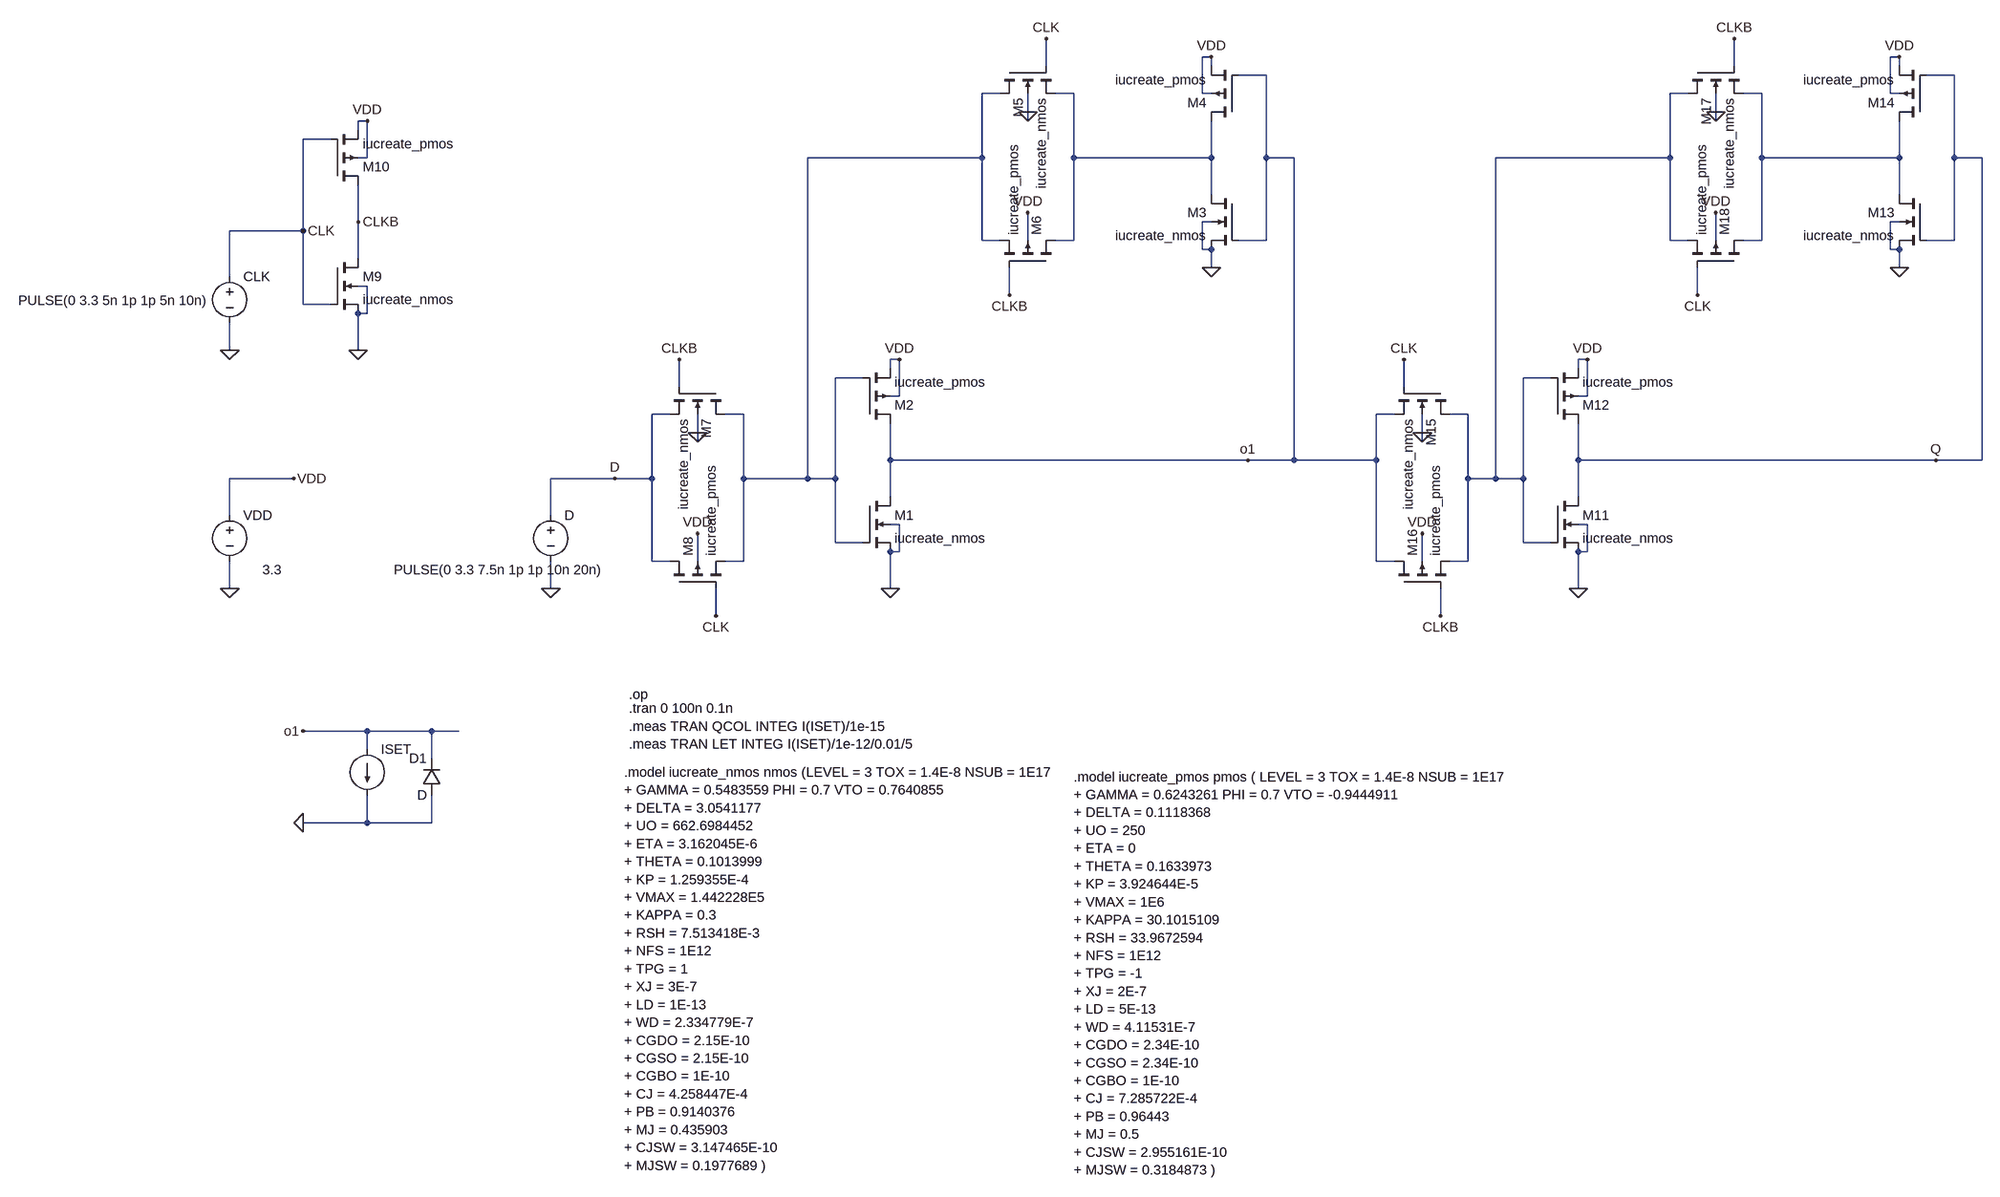
[diagram p0: schematic see_hw_dff_p1.asc]
see_hw_dff_p1.asc, the LTspice schematic file:
Version 4
SHEET 1 2536 1352
WIRE 1024 -736 1008 -736
WIRE 2224 -736 2208 -736
WIRE 736 -720 736 -768
WIRE 1024 -720 1024 -736
WIRE 1936 -720 1936 -768
WIRE 2224 -720 2224 -736
WIRE 1120 -704 1072 -704
WIRE 2320 -704 2272 -704
WIRE 656 -672 624 -672
WIRE 784 -672 752 -672
WIRE 1008 -672 1008 -736
WIRE 1024 -672 1008 -672
WIRE 1856 -672 1824 -672
WIRE 1984 -672 1952 -672
WIRE 2208 -672 2208 -736
WIRE 2224 -672 2208 -672
WIRE 704 -640 704 -672
WIRE 1904 -640 1904 -672
WIRE -448 -624 -464 -624
WIRE 704 -624 704 -640
WIRE 1904 -624 1904 -640
WIRE -464 -608 -464 -624
WIRE -512 -592 -560 -592
WIRE -448 -560 -448 -624
WIRE -448 -560 -464 -560
WIRE 624 -560 624 -672
WIRE 624 -560 320 -560
WIRE 784 -560 784 -672
WIRE 1024 -560 1024 -624
WIRE 1024 -560 784 -560
WIRE 1120 -560 1120 -704
WIRE 1168 -560 1120 -560
WIRE 1824 -560 1824 -672
WIRE 1824 -560 1520 -560
WIRE 1984 -560 1984 -672
WIRE 2224 -560 2224 -624
WIRE 2224 -560 1984 -560
WIRE 2320 -560 2320 -704
WIRE 2368 -560 2320 -560
WIRE 1024 -496 1024 -560
WIRE 2224 -496 2224 -560
WIRE -464 -448 -464 -512
WIRE 1024 -448 1008 -448
WIRE 2224 -448 2208 -448
WIRE -560 -432 -560 -592
WIRE -560 -432 -688 -432
WIRE 624 -416 624 -560
WIRE 656 -416 624 -416
WIRE 704 -416 704 -464
WIRE 784 -416 784 -560
WIRE 784 -416 752 -416
WIRE 1120 -416 1120 -560
WIRE 1120 -416 1072 -416
WIRE 1824 -416 1824 -560
WIRE 1856 -416 1824 -416
WIRE 1904 -416 1904 -464
WIRE 1984 -416 1984 -560
WIRE 1984 -416 1952 -416
WIRE 2320 -416 2320 -560
WIRE 2320 -416 2272 -416
WIRE 1008 -400 1008 -448
WIRE 1024 -400 1008 -400
WIRE 2208 -400 2208 -448
WIRE 2224 -400 2208 -400
WIRE -464 -384 -464 -448
WIRE 1024 -368 1024 -400
WIRE 2224 -368 2224 -400
WIRE -688 -352 -688 -432
WIRE -448 -336 -464 -336
WIRE 672 -320 672 -368
WIRE 1872 -320 1872 -368
WIRE -560 -304 -560 -432
WIRE -512 -304 -560 -304
WIRE -448 -288 -448 -336
WIRE -448 -288 -464 -288
WIRE -688 -224 -688 -272
WIRE -464 -224 -464 -288
WIRE 480 -208 464 -208
WIRE 1680 -208 1664 -208
WIRE 464 -192 464 -208
WIRE 1664 -192 1664 -208
WIRE 416 -176 368 -176
WIRE 1616 -176 1568 -176
WIRE 96 -160 96 -208
WIRE 1360 -160 1360 -208
WIRE 480 -144 480 -208
WIRE 480 -144 464 -144
WIRE 1680 -144 1680 -208
WIRE 1680 -144 1664 -144
WIRE 80 -112 48 -112
WIRE 208 -112 176 -112
WIRE 1344 -112 1312 -112
WIRE 1472 -112 1440 -112
WIRE 128 -80 128 -112
WIRE 1392 -80 1392 -112
WIRE 128 -64 128 -80
WIRE 1392 -64 1392 -80
WIRE 464 -32 464 -96
WIRE 1088 -32 464 -32
WIRE 1168 -32 1168 -560
WIRE 1168 -32 1088 -32
WIRE 1312 -32 1312 -112
WIRE 1312 -32 1168 -32
WIRE 1664 -32 1664 -96
WIRE 2288 -32 1664 -32
WIRE 2368 -32 2368 -560
WIRE 2368 -32 2288 -32
WIRE -576 0 -688 0
WIRE -16 0 -128 0
WIRE 48 0 48 -112
WIRE 48 0 -16 0
WIRE 208 0 208 -112
WIRE 320 0 320 -560
WIRE 320 0 208 0
WIRE 368 0 368 -176
WIRE 368 0 320 0
WIRE 1472 0 1472 -112
WIRE 1520 0 1520 -560
WIRE 1520 0 1472 0
WIRE 1568 0 1568 -176
WIRE 1568 0 1520 0
WIRE 464 32 464 -32
WIRE 1664 32 1664 -32
WIRE -688 64 -688 0
WIRE -128 64 -128 0
WIRE 480 80 464 80
WIRE 1680 80 1664 80
WIRE 368 112 368 0
WIRE 416 112 368 112
WIRE 1568 112 1568 0
WIRE 1616 112 1568 112
WIRE 480 128 480 80
WIRE 480 128 464 128
WIRE 1680 128 1680 80
WIRE 1680 128 1664 128
WIRE 48 144 48 0
WIRE 80 144 48 144
WIRE 128 144 128 96
WIRE 208 144 208 0
WIRE 208 144 176 144
WIRE 1312 144 1312 -32
WIRE 1344 144 1312 144
WIRE 1392 144 1392 96
WIRE 1472 144 1472 0
WIRE 1472 144 1440 144
WIRE -688 192 -688 144
WIRE -128 192 -128 144
WIRE 464 192 464 128
WIRE 1664 192 1664 128
WIRE 160 240 160 192
WIRE 1424 240 1424 192
WIRE -448 624 -560 624
WIRE -336 624 -448 624
WIRE -288 624 -336 624
WIRE -448 656 -448 624
WIRE -336 672 -336 624
WIRE -448 784 -448 736
WIRE -448 784 -560 784
WIRE -336 784 -336 736
WIRE -336 784 -448 784
FLAG 464 192 0
FLAG -128 192 0
FLAG 1024 -368 0
FLAG -688 -224 0
FLAG -464 -224 0
FLAG -560 -432 CLK
FLAG -464 -448 CLKB
FLAG 96 -208 CLKB
FLAG 160 240 CLK
FLAG 128 96 VDD
FLAG 128 -80 0
FLAG -16 0 D
FLAG 736 -768 CLK
FLAG 672 -320 CLKB
FLAG 704 -464 VDD
FLAG 704 -640 0
FLAG 480 -208 VDD
FLAG 1024 -736 VDD
FLAG 1088 -32 o1
FLAG -448 -624 VDD
FLAG 1664 192 0
FLAG 2224 -368 0
FLAG 1360 -208 CLK
FLAG 1424 240 CLKB
FLAG 1392 96 VDD
FLAG 1392 -80 0
FLAG 1936 -768 CLKB
FLAG 1872 -320 CLK
FLAG 1904 -464 VDD
FLAG 1904 -640 0
FLAG 1680 -208 VDD
FLAG 2224 -736 VDD
FLAG 2288 -32 Q
FLAG -688 192 0
FLAG -576 0 VDD
FLAG -560 624 o1
FLAG -560 784 0
SYMBOL voltage -128 48 R0
WINDOW 3 91 111 Right 2
SYMATTR Value PULSE(0 3.3 7.5n 1p 1p 10n 20n)
SYMATTR InstName D
SYMATTR Value2 AC 1
SYMBOL nmos4 416 32 R0
SYMATTR InstName M1
SYMATTR Value iucreate_nmos
SYMATTR Value2 l=0.5u w=1.5u
SYMBOL pmos4 416 -96 M180
SYMATTR InstName M2
SYMATTR Value iucreate_pmos
SYMATTR Value2 l=0.5u w=3.5u
SYMBOL nmos4 1072 -496 M0
SYMATTR InstName M3
SYMATTR Value iucreate_nmos
SYMATTR Value2 l=0.5u w=1.5u
SYMBOL pmos4 1072 -624 R180
SYMATTR InstName M4
SYMATTR Value iucreate_pmos
SYMATTR Value2 l=0.5u w=3.5u
SYMBOL current -448 656 R0
WINDOW 3 24 80 Invisible 0
SYMATTR Value EXP(0 0.5m 22n 10p 22.001n 5n)
SYMATTR InstName ISET
SYMBOL diode -320 736 R180
WINDOW 0 24 64 Left 2
WINDOW 3 24 0 Left 2
SYMATTR InstName D1
SYMBOL nmos4 176 -160 R90
SYMATTR InstName M7
SYMATTR Value iucreate_nmos
SYMATTR Value2 l=0.5u w=1.5u
SYMBOL voltage -688 -368 R0
WINDOW 3 -38 57 Right 2
SYMATTR Value PULSE(0 3.3 5n 1p 1p 5n 10n)
SYMATTR InstName CLK
SYMATTR Value2 AC 1
SYMBOL pmos4 80 192 R270
SYMATTR InstName M8
SYMATTR Value iucreate_pmos
SYMATTR Value2 l=0.5u w=1.5u
SYMBOL nmos4 -512 -384 R0
SYMATTR InstName M9
SYMATTR Value iucreate_nmos
SYMATTR Value2 l=0.5u w=1.5u
SYMBOL pmos4 -512 -512 M180
SYMATTR InstName M10
SYMATTR Value iucreate_pmos
SYMATTR Value2 l=0.5u w=3.5u
SYMBOL nmos4 656 -720 M90
SYMATTR InstName M5
SYMATTR Value iucreate_nmos
SYMATTR Value2 l=0.5u w=1.5u
SYMBOL pmos4 752 -368 M270
SYMATTR InstName M6
SYMATTR Value iucreate_pmos
SYMATTR Value2 l=0.5u w=1.5u
SYMBOL nmos4 1616 32 R0
SYMATTR InstName M11
SYMATTR Value iucreate_nmos
SYMATTR Value2 l=0.5u w=1.5u
SYMBOL pmos4 1616 -96 M180
SYMATTR InstName M12
SYMATTR Value iucreate_pmos
SYMATTR Value2 l=0.5u w=3.5u
SYMBOL nmos4 2272 -496 M0
SYMATTR InstName M13
SYMATTR Value iucreate_nmos
SYMATTR Value2 l=0.5u w=1.5u
SYMBOL pmos4 2272 -624 R180
SYMATTR InstName M14
SYMATTR Value iucreate_pmos
SYMATTR Value2 l=0.5u w=3.5u
SYMBOL nmos4 1440 -160 R90
SYMATTR InstName M15
SYMATTR Value iucreate_nmos
SYMATTR Value2 l=0.5u w=1.5u
SYMBOL pmos4 1344 192 R270
SYMATTR InstName M16
SYMATTR Value iucreate_pmos
SYMATTR Value2 l=0.5u w=1.5u
SYMBOL nmos4 1856 -720 M90
SYMATTR InstName M17
SYMATTR Value iucreate_nmos
SYMATTR Value2 l=0.5u w=1.5u
SYMBOL pmos4 1952 -368 M270
SYMATTR InstName M18
SYMATTR Value iucreate_pmos
SYMATTR Value2 l=0.5u w=1.5u
SYMBOL voltage -688 48 R0
WINDOW 3 91 111 Right 2
SYMATTR Value 3.3
SYMATTR InstName VDD
SYMATTR Value2 AC 1
TEXT 8 560 Left 2 !.op
TEXT 0 696 Left 2 !.model iucreate_nmos nmos (LEVEL = 3 TOX = 1.4E-8 NSUB = 1E17 \n+ GAMMA = 0.5483559 PHI = 0.7 VTO = 0.7640855\n+ DELTA = 3.0541177\n+ UO = 662.6984452\n+ ETA = 3.162045E-6\n+ THETA = 0.1013999\n+ KP = 1.259355E-4\n+ VMAX = 1.442228E5\n+ KAPPA = 0.3\n+ RSH = 7.513418E-3\n+ NFS = 1E12\n+ TPG = 1\n+ XJ = 3E-7\n+ LD = 1E-13\n+ WD = 2.334779E-7\n+ CGDO = 2.15E-10\n+ CGSO = 2.15E-10\n+ CGBO = 1E-10\n+ CJ = 4.258447E-4\n+ PB = 0.9140376\n+ MJ = 0.435903\n+ CJSW = 3.147465E-10\n+ MJSW = 0.1977689 )
TEXT 784 704 Left 2 !.model iucreate_pmos pmos ( LEVEL = 3 TOX = 1.4E-8 NSUB = 1E17\n+ GAMMA = 0.6243261 PHI = 0.7 VTO = -0.9444911\n+ DELTA = 0.1118368\n+ UO = 250\n+ ETA = 0\n+ THETA = 0.1633973\n+ KP = 3.924644E-5\n+ VMAX = 1E6\n+ KAPPA = 30.1015109\n+ RSH = 33.9672594\n+ NFS = 1E12\n+ TPG = -1\n+ XJ = 2E-7\n+ LD = 5E-13\n+ WD = 4.11531E-7\n+ CGDO = 2.34E-10\n+ CGSO = 2.34E-10\n+ CGBO = 1E-10\n+ CJ = 7.285722E-4\n+ PB = 0.96443\n+ MJ = 0.5\n+ CJSW = 2.955161E-10\n+ MJSW = 0.3184873 )
TEXT 8 584 Left 2 !.tran 0 100n 0.1n
TEXT 8 616 Left 2 !.meas TRAN QCOL INTEG I(ISET)/1e-15\n.meas TRAN LET INTEG I(ISET)/1e-12/0.01/5

The netlist it stands for:
* see_hw_dff_p1.asc
V§D D 0 PULSE(0 3.3 7.5n 1p 1p 10n 20n) AC 1
M1 o1 N001 0 0 iucreate_nmos l=0.5u w=1.5u
M2 o1 N001 VDD VDD iucreate_pmos l=0.5u w=3.5u
M3 N002 o1 0 0 iucreate_nmos l=0.5u w=1.5u
M4 N002 o1 VDD VDD iucreate_pmos l=0.5u w=3.5u
ISET o1 0 EXP(0 0.5m 22n 10p 22.001n 5n)
D1 0 o1 D
M7 N001 CLKB D 0 iucreate_nmos l=0.5u w=1.5u
V§CLK CLK 0 PULSE(0 3.3 5n 1p 1p 5n 10n) AC 1
M8 D CLK N001 VDD iucreate_pmos l=0.5u w=1.5u
M9 CLKB CLK 0 0 iucreate_nmos l=0.5u w=1.5u
M10 CLKB CLK VDD VDD iucreate_pmos l=0.5u w=3.5u
M5 N001 CLK N002 0 iucreate_nmos l=0.5u w=1.5u
M6 N002 CLKB N001 VDD iucreate_pmos l=0.5u w=1.5u
M11 Q N003 0 0 iucreate_nmos l=0.5u w=1.5u
M12 Q N003 VDD VDD iucreate_pmos l=0.5u w=3.5u
M13 N004 Q 0 0 iucreate_nmos l=0.5u w=1.5u
M14 N004 Q VDD VDD iucreate_pmos l=0.5u w=3.5u
M15 N003 CLK o1 0 iucreate_nmos l=0.5u w=1.5u
M16 o1 CLKB N003 VDD iucreate_pmos l=0.5u w=1.5u
M17 N003 CLKB N004 0 iucreate_nmos l=0.5u w=1.5u
M18 N004 CLK N003 VDD iucreate_pmos l=0.5u w=1.5u
VDD VDD 0 3.3 AC 1
.model D D
.lib standard.dio
.model NMOS NMOS
.model PMOS PMOS
.lib standard.mos
.op
.model iucreate_nmos nmos (LEVEL = 3 TOX = 1.4E-8 NSUB = 1E17
+ GAMMA = 0.5483559 PHI = 0.7 VTO = 0.7640855
+ DELTA = 3.0541177
+ UO = 662.6984452
+ ETA = 3.162045E-6
+ THETA = 0.1013999
+ KP = 1.259355E-4
+ VMAX = 1.442228E5
+ KAPPA = 0.3
+ RSH = 7.513418E-3
+ NFS = 1E12
+ TPG = 1
+ XJ = 3E-7
+ LD = 1E-13
+ WD = 2.334779E-7
+ CGDO = 2.15E-10
+ CGSO = 2.15E-10
+ CGBO = 1E-10
+ CJ = 4.258447E-4
+ PB = 0.9140376
+ MJ = 0.435903
+ CJSW = 3.147465E-10
+ MJSW = 0.1977689 )
.model iucreate_pmos pmos ( LEVEL = 3 TOX = 1.4E-8 NSUB = 1E17
+ GAMMA = 0.6243261 PHI = 0.7 VTO = -0.9444911
+ DELTA = 0.1118368
+ UO = 250
+ ETA = 0
+ THETA = 0.1633973
+ KP = 3.924644E-5
+ VMAX = 1E6
+ KAPPA = 30.1015109
+ RSH = 33.9672594
+ NFS = 1E12
+ TPG = -1
+ XJ = 2E-7
+ LD = 5E-13
+ WD = 4.11531E-7
+ CGDO = 2.34E-10
+ CGSO = 2.34E-10
+ CGBO = 1E-10
+ CJ = 7.285722E-4
+ PB = 0.96443
+ MJ = 0.5
+ CJSW = 2.955161E-10
+ MJSW = 0.3184873 )
.tran 0 100n 0.1n
.meas TRAN QCOL INTEG I(ISET)/1e-15
.meas TRAN LET INTEG I(ISET)/1e-12/0.01/5
.backanno
.end